# EAGLE design nfc_with_data_transfer_no_accel (EAGLE 7.6.0)
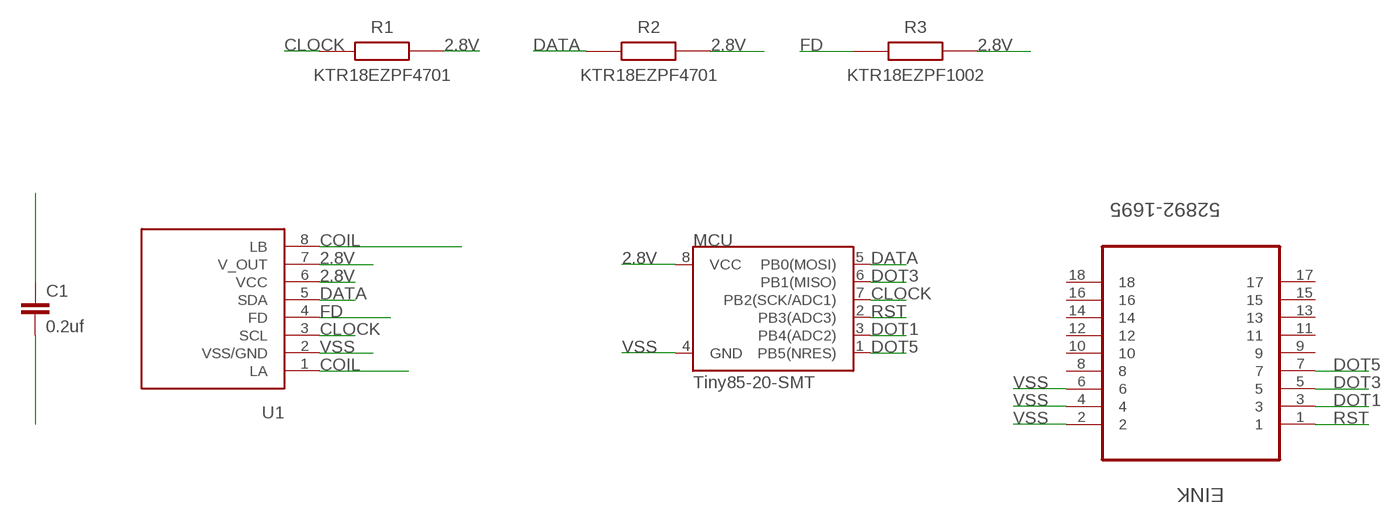
[diagram p0: schematic, sheet 1]

## Parts
C1  0.2uf  CAP1206  [1206]
EINK  52892-1695  [MOLEX_52892-1695]
MCU  Tiny85-20-SMT  ATTINY45TINY85-20-SMT  [SO08-EIAJ]
R1  KTR18EZPF4701  [RESC3216X65N]
R2  KTR18EZPF4701  [RESC3216X65N]
R3  KTR18EZPF1002  [RESC3216X65N]
U1  NT3H1101  [NT3H1101]

## Nets
2.8V: C1.1 MCU.8(VCC) R1.2 R2.2 R3.2 U1.6(VCC) U1.7(V_OUT)
CLOCK: MCU.7(PB2(SCK/ADC1)) R1.1 U1.3(SCL)
COIL: U1.1(LA) U1.8(LB)
DATA: MCU.5(PB0(MOSI)) R2.1 U1.5(SDA)
DOT1: EINK.3 MCU.3(PB4(ADC2))
DOT3: EINK.5 MCU.6(PB1(MISO))
DOT5: EINK.7
FD: R3.1 U1.4(FD)
RST: EINK.1 MCU.2(PB3(ADC3))
VSS: C1.2 EINK.2 EINK.4 EINK.6 MCU.4(GND) U1.2(VSS/GND)
Unconnected: EINK.8 EINK.9 EINK.10 EINK.11 EINK.12 EINK.13 EINK.14 EINK.15 EINK.16 EINK.17 EINK.18 MCU.1(PB5(NRES))

## Library data of the parts
C1 = SparkFun-Capacitors:CAP: Capacitor Standard 0603 ceramic capacitor, and 0.1" leaded capacitor.
EINK = Molex_By_element14_Batch_1:52892-1695: CONNECTOR, FPC, ZIF, 0.50MM, 16 WAY; MPN: 52892-1695; OC_FARNELL: 1556807; OC_NEWARK: 92M6601; PACKAGE: CONNECTOR, FPC, ZIF, 0.50MM, 16 WAY; SUPPLIER: Molex
MCU = SparkFun-DigitalIC:ATTINY45: Atmel 8-pin 2/4/8kB flash uC; PROD_ID: IC-09092
R1 R2 = KTR18EZPF4701:KTR18EZPF4701: Thick Film Resistors - SMD 1206 4K7ohm 1% High VoltageAEC-Q200 <https://componentsearchengine.com/Images/1/KTR18EZPF4701.jpg> Source: Datasheet <http://rohmfs.rohm.com/en/products/databook/datasheet/passive/resistor/chip_resistor/ktr.pdf>; DESCRIPTION: Thick Film Resistors - SMD 1206 4K7ohm 1% High VoltageAEC-Q200; HEIGHT: 0.65mm; MANUFACTURER_NAME: ROHM Semiconductor; MANUFACTURER_PART_NUMBER: KTR18EZPF4701
R3 = KTR18EZPF1002:KTR18EZPF1002: Thick Film Resistors - SMD 1206 10Kohm 1% High VoltageAEC-Q200 <https://componentsearchengine.com/Images/1/KTR18EZPF1002.jpg> Source: Datasheet <http://rohmfs.rohm.com/en/products/databook/datasheet/passive/resistor/chip_resistor/ktr.pdf>; DESCRIPTION: Thick Film Resistors - SMD 1206 10Kohm 1% High VoltageAEC-Q200; HEIGHT: 0.65mm; MANUFACTURER_NAME: ROHM Semiconductor; MANUFACTURER_PART_NUMBER: KTR18EZPF1002
U1 = AlterNail:NT3H1101

## Board
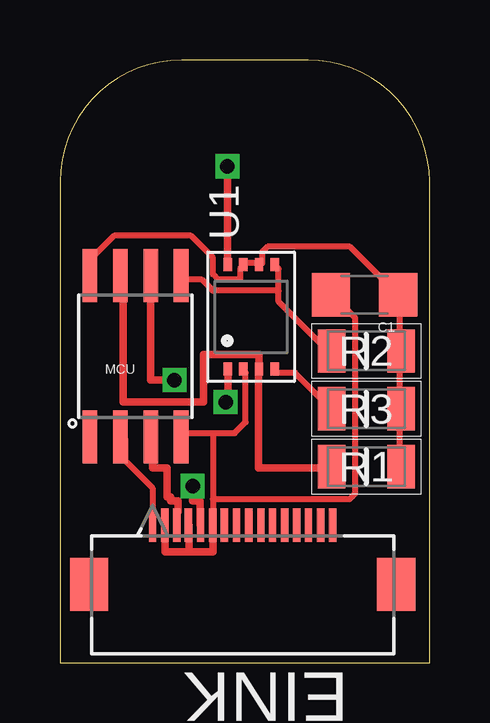
[diagram p1: board, top side]
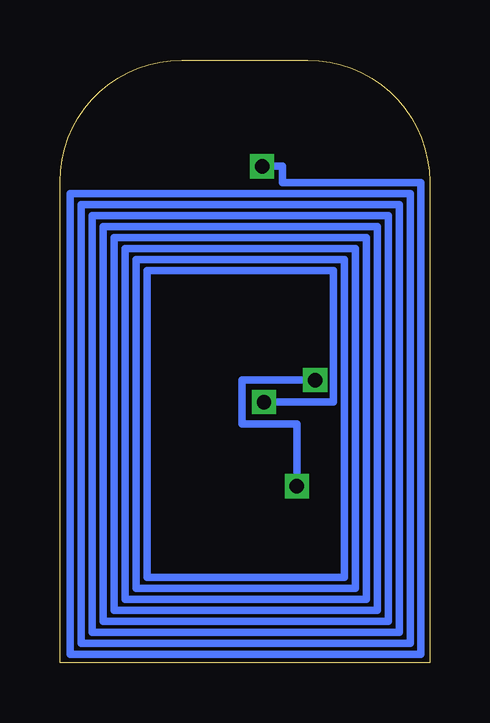
[diagram p2: board, bottom side, seen from below]

Size 15.42 x 25.14 mm. Coordinates in mm from the lower left corner, seen from the top.
Outline: 0,0 15.42,0 15.42,20.06 arc90 10.34,25.14 5.08,25.14 arc90 0,20.06 0,0
Copper layers (1*16): Top 0.035mm / dielectric 1.5mm / Bottom 0.035mm
Design rules "default": minimum track width 10mil, minimum drill 24mil, track to track 8mil, track to pad 8mil, pad to pad 8mil, via to via 8mil, smd to smd 8mil, copper to edge 40mil, drill to drill 8mil, minimum pad ring 10mil, minimum via ring 8mil, stop-mask expansion 4mil, vias tented up to drill 0mil, thermal gap 10mil

### Footprints (pad centres in the part's own frame; a part is rotated, then mirrored left to right if it is on the bottom)
1206 = smd 1.6 x 1.8: 1 -1.4,0; 2 1.4,0
MOLEX_52892-1695 = smd 0.305 x 1.397: 1 3.759,2.896; 2 3.251,2.896; 3 2.743,2.896; 4 2.261,2.896; 5 1.753,2.896; 6 1.245,2.896; 7 0.762,2.896; 8 0.254,2.896; 9 -0.254,2.896; 10 -0.762,2.896; 11 -1.245,2.896; 12 -1.753,2.896; 13 -2.261,2.896; 14 -2.743,2.896; 15 -3.251,2.896; 16 -3.759,2.896 | smd 1.6 x 2.21: 17 -6.401,5.359; 18 6.401,5.359
SO08-EIAJ = smd 0.61 x 2.21: 1 -1.905,-3.378; 2 -0.635,-3.378; 3 0.635,-3.378; 4 1.905,-3.378; 5 1.905,3.353; 6 0.635,3.353; 7 -0.635,3.353; 8 -1.905,3.353
RESC3216X65N = smd 1.15 x 1.8: 1 -1.45,0; 2 1.45,0
NT3H1101 = smd 0.55 x 0.35: 1 -2.175,0.975; 2 -2.175,0.325; 3 -2.175,-0.325; 4 -2.175,-0.975; 5 2.175,-0.975; 6 2.175,-0.325; 7 2.175,0.325; 8 2.175,0.975; P$5 -2.175,-0.325

### Placement (x,y rotation side)
C1  12.7,15.34 180 top
EINK  7.62,8.64 180 top
MCU  3.15,12.8 0 top
R1  12.78,8.18 0 top
R2  12.78,13 0 top
R3  12.78,10.59 0 top
U1  7.98,14.43 90 top

### Tracks (layer width: path | path; a pad name or v marks a point on that pad's centre or on a via)
2.8V
  Top 0.254: R1.2 14.15,8.2 14.15,10.49 R3.2 14.15,10.72 14.15,13.01 | 14.15,13.01 14.15,15.29 C1.1 13.92,15.52 12.09,17.35 8.66,17.35 8.43,17.12 8.43,16.66 U1.6 8.2,16.66 7.75,16.66 U1.7 7.52,16.43 7.52,15.98 6.6,15.98 6.37,16.2 6.37,16.89 5.46,17.8 2.26,17.8 1.35,16.89 | 1.35,16.89 1.35,16.2 MCU.8 1.35,16.89 | 14.15,13.01 R2.2
CLOCK
  Top 0.305: MCU.7 2.64,16.15 2.64,10.87 5.99,10.87 5.99,12.85 8.3,12.85 U1.3 8.28,12.25 8.28,8.13 11.33,8.13 R1.1
COIL  (via drill 0.6)
  Top 0.305: v6.91,10.87 7,10.87 U1.1 | U1.8 6.99,16.6 v6.99,20.7
  Bottom 0.305: v6.91,10.87 4.01,10.87 4.01,16.36 11.79,16.36 11.79,3.56 3.56,3.56 3.56,16.81 12.24,16.81 12.24,3.1 3.1,3.1 3.1,17.27 12.7,17.27 12.7,2.64 2.64,2.64 2.64,17.73 13.16,17.73 13.16,2.18 2.18,2.18 2.18,18.19 13.61,18.19 13.61,1.73 1.73,1.73 1.73,18.64 14.07,18.64 14.07,1.27 1.27,1.27 1.27,19.1 14.53,19.1 14.53,0.81 0.81,0.81 0.81,19.56 14.99,19.56 14.99,0.36 0.36,0.36 0.36,20.01 6.15,20.01 6.15,20.7 v6.99,20.7
DATA
  Top 0.254: 9.12,15.52 9.12,15.06 11.18,13.01 R2.1 | 9.12,15.52 9.12,16.43 U1.5 | 9.12,15.52 6.37,15.52 5.92,15.98 5.23,15.98 MCU.5
DOT1
  Top 0.305: MCU.3 3.86,9.42 3.86,8.13 4.47,8.13 4.47,6.91 4.62,6.91 4.62,6.76 4.93,6.76 4.93,6.3 4.88,6.3 EINK.3
DOT3  (via drill 0.6)
  Top 0.305: EINK.5 5.84,5.74 5.84,6.76 5.54,6.76 v5.54,7.37 | v4.78,11.79 3.79,11.79 MCU.6
  Bottom 0.305: v5.54,7.37 5.54,9.96 7.82,9.96 7.82,11.79 v4.78,11.79
FD
  Top 0.254: U1.4 9.12,12.09 9.8,12.09 11.18,10.72 R3.1
RST
  Top 0.254: EINK.1 3.86,7.29 2.72,8.43 2.72,9.35 MCU.2
VSS
  Top 0.254: 6.37,9.58 5.23,9.58 MCU.4 | 6.37,9.58 7.29,9.58 7.75,10.03 7.75,12.09 U1.2 | 6.37,9.58 6.37,6.83 | 6.37,6.83 EINK.6 | 6.37,6.83 12.09,6.83 12.32,7.06 12.32,14.38 11.41,15.29 C1.2
  Top 0.305: EINK.2 4.39,5.74 4.39,4.62 5.38,4.62 | 5.38,4.62 6.37,4.62 EINK.6 | EINK.4 5.38,5.74 5.38,4.62